# Altium schematic sheet BLE_Sensors_LEDs.SchDoc
size A
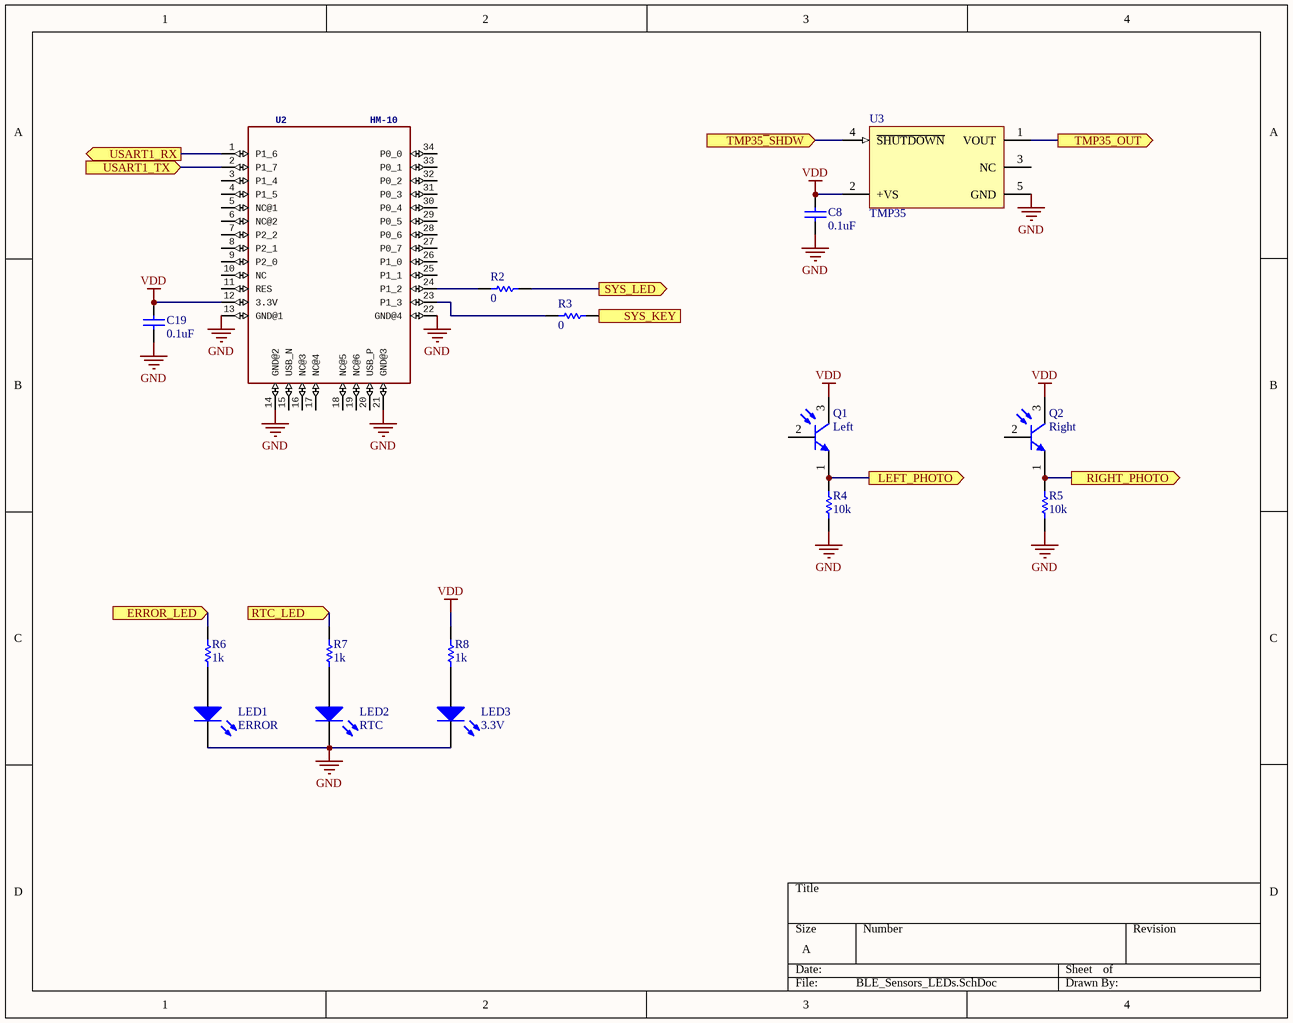
[diagram p0: BLE_Sensors_LEDs.SchDoc]

## Parts
C8  0.1uF  [CAPC1608X90X40ML10T20]
C19  0.1uF  [CAPC1608X90X40ML10T20]
LED1  ERROR  [0805_A]
LED2  RTC  [0805_A]
LED3  3.3V  [0805_A]
Q1  Left  [VSIL-TEMT6000X01_V]
Q2  Right  [VSIL-TEMT6000X01_V]
R2  0  [RESC2013X50X30LL20T20]
R3  0  [RESC2013X50X30LL20T20]
R4  10k  [RESC1608X55X30LL15T15]
R5  10k  [RESC1608X55X30LL15T15]
R6  1k  [RESC1608X55X30LL20T20]
R7  1k  [RESC1608X55X30LL20T20]
R8  1k  [RESC1608X55X30LL20T20]
U2  HM-10  [HM-10]
U3  TMP35  [ADI-RJ-5_M]

## Ports
ERROR_LED (in), LEFT_PHOTO (out), RIGHT_PHOTO (out), RTC_LED (in), SYS_KEY (in), SYS_LED (out), TMP35_OUT (out), TMP35~{_}SHDW (in), USART1_RX (out), USART1_TX (in)

## Nets
GND: C8.1 C19.1 LED1.1(K) LED2.1(K) LED3.1(K) R4.1 R5.1 U2.13(GND@1) U2.14(GND@2) U2.21(GND@3) U2.22(GND@4) U3.5(GND)
VDD: C8.2 C19.2 Q1.3(C) Q2.3(C) R8.2 U2.12(3.3V) U3.2(+VS)
ERROR_LED: R6.2 ; port ERROR_LED
LEFT_PHOTO: Q1.1(E) R4.2 ; port LEFT_PHOTO
RIGHT_PHOTO: Q2.1(E) R5.2 ; port RIGHT_PHOTO
RTC_LED: R7.2 ; port RTC_LED
SYS_KEY: R3.2 ; port SYS_KEY
SYS_LED: R2.2 ; port SYS_LED
TMP35~{_}SHDW: U3.4(~{SHUTDOWN}) ; port TMP35~{_}SHDW
TMP35_OUT: U3.1(VOUT) ; port TMP35_OUT
USART1_RX: U2.1(P1_6) ; port USART1_RX
USART1_TX: U2.2(P1_7) ; port USART1_TX
NetLED1_2: LED1.2(A) R6.1
NetLED2_2: LED2.2(A) R7.1
NetLED3_2: LED3.2(A) R8.1
NetR2_1: R2.1 U2.24(P1_2)
NetR3_1: R3.1 U2.23(P1_3)

Not connected (* = marked no-connect by the designer): Q1 2(B); Q2 2(B); U2 3(P1_4) 4(P1_5) 5(NC@1) 6(NC@2) 7(P2_2) 8(P2_1) 9(P2_0) 10(NC) 11(RES) 15(USB_N) 16(NC@3) 17(NC@4) 18(NC@5) 19(NC@6) 20(USB_P) 25(P1_1) 26(P1_0) 27(P0_7) 28(P0_6) 29(P0_5) 30(P0_4) 31(P0_3) 32(P0_2) 33(P0_1) 34(P0_0); U3 3(NC)

## Library data of the parts
C8 C19 = CMP-2000-05002-1: Ceramic Multilayer Capacitor, 100 nF, +/- 10%, 50 V, -55 to 155 degC, 0603 (1608 Metric), RoHS, Tape and Reel; Manufacturer: Yageo; Online Catalog: CCSeries; Voltage - Rated: 16V; Product Training Modules: MultilayerCeramicCapacitors; Other Names: 311-1088-6; Featured Product: CommodityMultilayerCeramicCapacitors–CCSeries; Capacitance: 0.1µF; Temperature Coefficient: X7R; Height - Seated (Max): -; Operating Temperature: -55degC~125degC; Package / Case: 0603(1608Metric); Datasheet URL: https://datasheet.ciiva.com/11786/0900766b80d84f1d-11786077.pdf; Package Description: 2-Pin Surface Mount Device, Body 1.6 x 0.8 mm; Family: CeramicCapacitors; Packaging: Digi-Reel; Size / Dimension: 0.063"Lx0.031"W(1.60mmx0.80mm); Thickness (Max): 0.035"(0.90mm); Series: CC; Lead Spacing: -; Features: -; Tolerance: ±10%; Lead Style: -; Ratings: -; Manufacturer URL: http://www.yageo.com/; Package Reference: 603; Standard Package: 1; Category: Capacitors; Mounting Type: SurfaceMount,MLCC; Applications: GeneralPurpose; Datasheet Version: Rev. 2, 05/2009
LED1-LED3 = CMP-1426-00010-1: SMD mono-color Chip LED, WL-SMCW, Super Red; Manufacturer: Wuerth Elektronik; PartNumber: 150080SS75000; PackageReference: 0805_A; ComponentLink2URL: http://katalog.we-online.com/led/datasheet/150080SS75000.pdf; ComponentLink1URL: http://www.we-online.com; Color: Super Red; ComponentLink2Description: Datasheet; ComponentLink1Description: Manufacturer URL
Q1 Q2 = CMP-1666-00035-1: Ambient Light Sensor / , 100 mW, -40 to 100 degC, 3-Pin SMD, RoHS, Tape and Reel; Nominal Vf: 2 V; Luminous Intensity: 54 mcd; Forward Current: 20 mA; Viewing Angle: 130 degrees; Lens Style: Diffused; Power Rating: 75 mW; Colour: Red; Case\Package: 0603; Case Code (Imperial): 0603; Package Quantity: 3000; Packaging: Tape and Reel; Width: 0.8 mm; ComponentLink2URL: http://www.vishay.com/docs/81579/temt6000.pdf; ComponentLink1Description: Manufacturer URL; ComponentLink2Description: Datasheet; Height: 0.8 mm; Mount: Surface Mount; Pins: 2; Case Code (Metric): 1608; Max Operating Temperature: 85 degC; DatasheetVersion: Rev. 1.9, 08/2011; Forward Voltage: 2 V; ComponentLink1URL: http://www.vishay.com/; Radiation Hardening: No; RoHSCompliant: true; Length: 1.6 mm; PackageReference: 1206; Min Operating Temperature: -55 degC; PackageDescription: 3-Pin Surface Mount Device, Body 4 x 2 mm; Illumination Colour: Red
R2 R3 = CMP-2001-04896-1: Manufacturer: Vishay Dale; Part Number: CRCW08050000Z0EA
R4 R5 = CMP-2000-00181-1: Part Number: ERJ-3EKF1002V; Manufacturer: Panasonic
R6-R8 = CMP-2000-00873-1: Manufacturer: Panasonic; Part Number: ERA3AEB102V
U2 = HM-10: GateName_1: G$1; SymbolName_1: HM-10; LibraryName: HM-10_BLE; DeviceSetName: HM-10; Package: HM-10
U3 = CMP-0887-00046-1: Voltage Output Temperature Sensor, 2.7 to 5.5 V Supply, Industrial, 5-pin SOT23 (RJ-5), Reel; PartNumber: TMP35GRTZ-REEL7; Manufacturer: Analog Devices; Mounting Technology: Surface Mount; ComponentLink1URL: http://www.analog.com/en/index.html; ComponentLink2Description: Datasheet; ComponentLink4Description: Product URL; Supply Voltage Range: 2.7 to 5.5 V; ComponentLink1Description: Manufacturer URL; ComponentLink4URL: http://www.analog.com/en/mems-sensors/digital-temperature-sensors/tmp35/products/product.html; ComponentLink3URL: http://www.analog.com/static/imported-files/packages/PKG_PDF/SOT-23(RJ)/RJ_5.pdf; PackageVersion: 121608-A , 12/2008; ComponentLink3Description: Package Specification; PackageReference: RJ-5; ComponentLink2URL: http://www.analog.com/static/imported-files/data_sheets/TMP35_36_37.pdf; DatasheetVersion: Rev. F; Packing: Reel; Code_JEDEC: MO-178-AA; PackageDescription: 5-Pin Small Outline Transistor Package, Body 2.9 x 1.6 mm, Pitch 0.95 mm